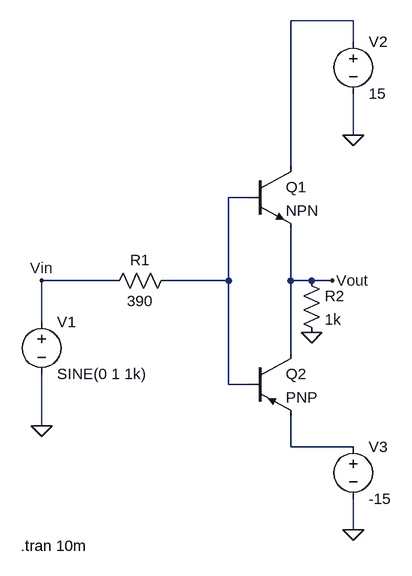
[diagram p0: schematic BJT push pull amplifier circuit.asc]
BJT push pull amplifier circuit.asc, the LTspice schematic file:
Version 4.1
SHEET 1 880 692
WIRE 352 -160 256 -160
WIRE 352 -128 352 -160
WIRE 352 16 352 -48
WIRE 256 64 256 -160
WIRE 192 112 160 112
WIRE -16 240 -128 240
WIRE 160 240 160 112
WIRE 160 240 64 240
WIRE 256 240 256 160
WIRE 288 240 256 240
WIRE 320 240 288 240
WIRE -128 304 -128 240
WIRE 256 352 256 240
WIRE 160 400 160 240
WIRE 192 400 160 400
WIRE -128 464 -128 384
WIRE 256 496 256 448
WIRE 352 496 256 496
WIRE 352 624 352 576
FLAG -128 464 0
FLAG 352 16 0
FLAG 352 624 0
FLAG 320 240 Vout
FLAG -128 240 Vin
FLAG 288 320 0
SYMBOL npn 192 64 R0
SYMATTR InstName Q1
SYMBOL pnp 192 352 R0
SYMATTR InstName Q2
SYMBOL res 80 224 R90
WINDOW 0 0 56 VBottom 2
WINDOW 3 32 56 VTop 2
SYMATTR InstName R1
SYMATTR Value 390
SYMBOL voltage -128 288 R0
WINDOW 123 0 0 Left 0
WINDOW 39 0 0 Left 0
SYMATTR InstName V1
SYMATTR Value SINE(0 1 1k)
SYMBOL voltage 352 -144 R0
WINDOW 123 0 0 Left 0
WINDOW 39 0 0 Left 0
SYMATTR InstName V2
SYMATTR Value 15
SYMBOL voltage 352 480 R0
WINDOW 123 0 0 Left 0
WINDOW 39 0 0 Left 0
SYMATTR InstName V3
SYMATTR Value -15
SYMBOL res 272 224 R0
SYMATTR InstName R2
SYMATTR Value 1k
TEXT -160 648 Left 2 !.tran 10m

The netlist it stands for:
* BJT push pull amplifier circuit.asc
Q1 N001 N002 Vout 0 NPN
Q2 Vout N002 N003 0 PNP
R1 N002 Vin 390
V1 Vin 0 SINE(0 1 1k)
V2 N001 0 15
V3 N003 0 -15
R2 Vout 0 1k
.model NPN NPN
.model PNP PNP
.lib standard.bjt
.tran 10m
.backanno
.end

* Results of the author's LTspice run, read from the files saved beside the schematic
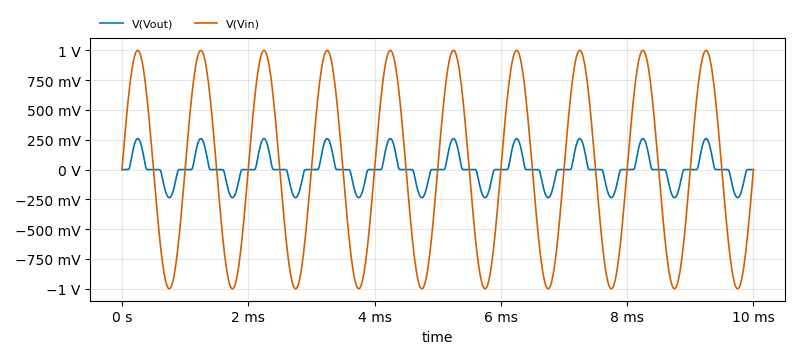
[diagram p1: Transient Analysis of BJT push pull amplifier circuit.asc, plotted from the saved traces]
* Transient Analysis, 1 run:
*   V(Vout): min -235.2 mV, max 259.9 mV, average 2.837 mV, rms 128.6 mV, last 0 V
*   V(Vin): min -1 V, max 1 V, average 699.1 nV, rms 707.4 mV, last 0 V